# Altium schematic sheet Motor Driver 175C.SchDoc: Motor Driver
size Tabloid; CompanyName: Vertex; Organization: Vertex Downhole Ltd.; Address1: 10911 50th Street SE; Address2: Calgary, AB; Address3: T2C 3E5; Address4: Canada; DocumentNumber: 550014; Revision: 4.1; SheetNumber: 8; SheetTotal: 8
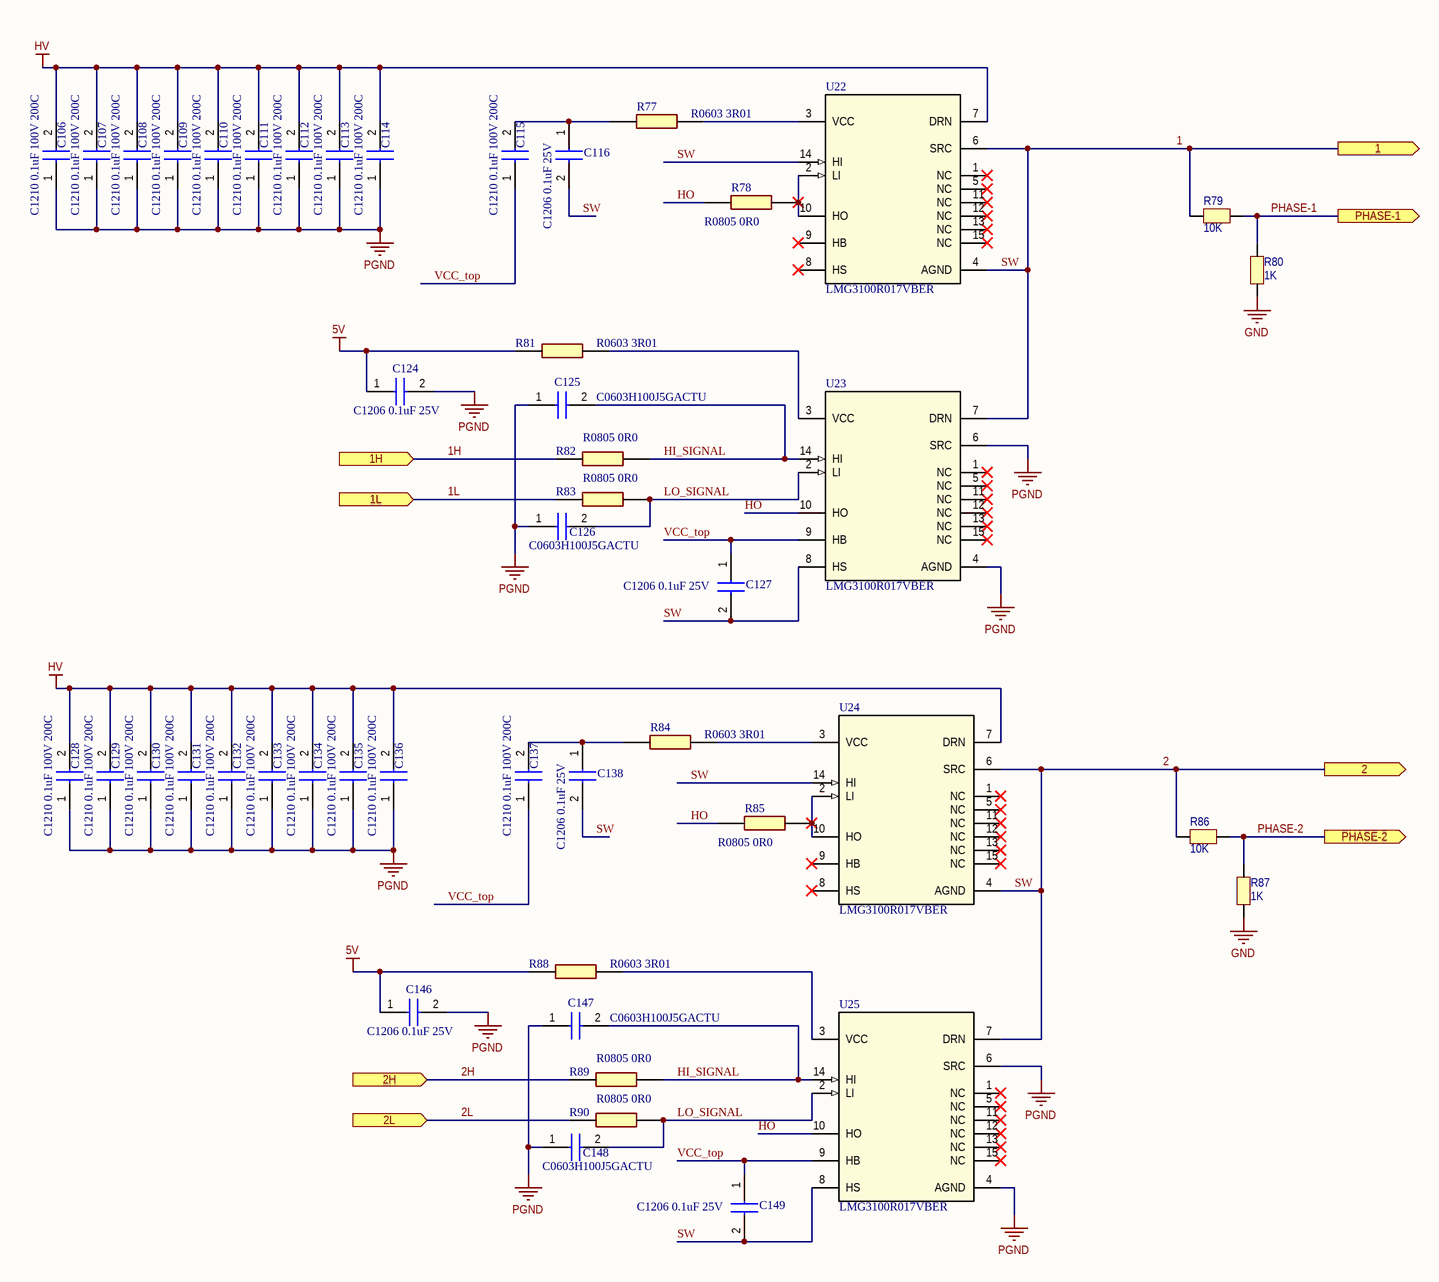
[diagram p0: Motor Driver 175C.SchDoc]

## Parts
C106  C1210 0.1uF 100V 200C  [C1210]
C107  C1210 0.1uF 100V 200C  [C1210]
C108  C1210 0.1uF 100V 200C  [C1210]
C109  C1210 0.1uF 100V 200C  [C1210]
C110  C1210 0.1uF 100V 200C  [C1210]
C111  C1210 0.1uF 100V 200C  [C1210]
C112  C1210 0.1uF 100V 200C  [C1210]
C113  C1210 0.1uF 100V 200C  [C1210]
C114  C1210 0.1uF 100V 200C  [C1210]
C115  C1210 0.1uF 100V 200C  [C1210]
C116  C1206 0.1uF 25V  [C1206]
C124  C1206 0.1uF 25V  [C1206]
C125  C0603H100J5GACTU  [C0603]
C126  C0603H100J5GACTU  [C0603]
C127  C1206 0.1uF 25V  [C1206]
C128  C1210 0.1uF 100V 200C  [C1210]
C129  C1210 0.1uF 100V 200C  [C1210]
C130  C1210 0.1uF 100V 200C  [C1210]
C131  C1210 0.1uF 100V 200C  [C1210]
C132  C1210 0.1uF 100V 200C  [C1210]
C133  C1210 0.1uF 100V 200C  [C1210]
C134  C1210 0.1uF 100V 200C  [C1210]
C135  C1210 0.1uF 100V 200C  [C1210]
C136  C1210 0.1uF 100V 200C  [C1210]
C137  C1210 0.1uF 100V 200C  [C1210]
C138  C1206 0.1uF 25V  [C1206]
C146  C1206 0.1uF 25V  [C1206]
C147  C0603H100J5GACTU  [C0603]
C148  C0603H100J5GACTU  [C0603]
C149  C1206 0.1uF 25V  [C1206]
R77  R0603 3R01  [RESC1608X55N]
R78  R0805 0R0  [RESC2012X60N]
R79  10K  [0805-CR]
R80  1K  [0805-CR]
R81  R0603 3R01  [RESC1608X55N]
R82  R0805 0R0  [RESC2012X60N]
R83  R0805 0R0  [RESC2012X60N]
R84  R0603 3R01  [RESC1608X55N]
R85  R0805 0R0  [RESC2012X60N]
R86  10K  [0805-CR]
R87  1K  [0805-CR]
R88  R0603 3R01  [RESC1608X55N]
R89  R0805 0R0  [RESC2012X60N]
R90  R0805 0R0  [RESC2012X60N]
U22  LMG3100R017VBER  [VBE0015A-MFG]
U23  LMG3100R017VBER  [VBE0015A-MFG]
U24  LMG3100R017VBER  [VBE0015A-MFG]
U25  LMG3100R017VBER  [VBE0015A-MFG]

## Ports
1 (out), 1H (in), 1L (in), 2 (out), 2H (in), 2L (in), PHASE-1 (out), PHASE-2 (out)

## Nets
5V: C124.1 C146.1 R81.1 R88.1
GND: R80.1 R87.1
HV: C106.2 C107.2 C108.2 C109.2 C110.2 C111.2 C112.2 C113.2 C114.2 C128.2 C129.2 C130.2 C131.2 C132.2 C133.2 C134.2 C135.2 C136.2 U22.7(DRN) U24.7(DRN)
PGND: C106.1 C107.1 C108.1 C109.1 C110.1 C111.1 C112.1 C113.1 C114.1 C124.2 C125.1 C126.1 C128.1 C129.1 C130.1 C131.1 C132.1 C133.1 C134.1 C135.1 C136.1 C146.2 C147.1 C148.1 U23.4(AGND) U23.6(SRC) U25.4(AGND) U25.6(SRC)
1: C116.2 C127.2 C138.2 C149.2 R79.1 R86.1 U22.4(AGND) U22.6(SRC) U22.14(HI) U23.7(DRN) U23.8(HS) U24.4(AGND) U24.6(SRC) U24.14(HI) U25.7(DRN) U25.8(HS) ; port 1, port 2  [also labelled 2, SW]
1H: R82.1 ; port 1H
1L: R83.1 ; port 1L
2H: R89.1 ; port 2H
2L: R90.1 ; port 2L
HI_SIGNAL: C125.2 C147.2 R82.2 R89.2 U23.14(HI) U25.14(HI)
HO: R78.1 R85.1 U23.10(HO) U25.10(HO)
LO_SIGNAL: C126.2 C148.2 R83.2 R90.2 U23.2(LI) U25.2(LI)
PHASE-1: R79.2 R80.2 ; port PHASE-1
PHASE-2: R86.2 R87.2 ; port PHASE-2
VCC_top: C115.1 C127.1 C137.1 C149.1 U23.9(HB) U25.9(HB)
NetC115_2: C115.2 C116.1 R77.1
NetC137_2: C137.2 C138.1 R84.1
NetR77_2: R77.2 U22.3(VCC)
NetR78_2: R78.2 U22.2(LI) U22.10(HO)
NetR81_2: R81.2 U23.3(VCC)
NetR84_2: R84.2 U24.3(VCC)
NetR85_2: R85.2 U24.2(LI) U24.10(HO)
NetR88_2: R88.2 U25.3(VCC)

Not connected (* = marked no-connect by the designer): U22 1(NC)* 5(NC)* 8(HS)* 9(HB)* 11(NC)* 12(NC)* 13(NC)* 15(NC)*; U23 1(NC)* 5(NC)* 11(NC)* 12(NC)* 13(NC)* 15(NC)*; U24 1(NC)* 5(NC)* 8(HS)* 9(HB)* 11(NC)* 12(NC)* 13(NC)* 15(NC)*; U25 1(NC)* 5(NC)* 11(NC)* 12(NC)* 13(NC)* 15(NC)*

## Notes on the sheet
- Title
- Size:
- Date:
- Tabloid
- Number:
- Time:
- Revision:
- Sheet
- of
- File:

## Library data of the parts
C106-C115 C128-C137 = C1210H104J1GACTU: Capacitor; Manufacturer_Name: KEMET; Datasheet Link: https://content.kemet.com/datasheets/KEM_C1001_C0G_200C_SMD.pdf; Manufacturer_Part_Number: C1210H104J1GACTU; Mouser Part Number: 80-C1210H104J1GACTU; Mouser Price/Stock: https://www.mouser.co.uk/ProductDetail/KEMET/C1210H104J1GACTU?qs=w3%252Bcv6FlocpP4mccX4tnSA%3D%3D; Operating Temperature Range: -55C to +200C
C116 C124 C127 C138 C146 C149 = C1206H104J3GACTU: Capacitor; Manufacturer_Name: KEMET; Datasheet Link: https://content.kemet.com/datasheets/KEM_C1001_C0G_200C_SMD.pdf; Manufacturer_Part_Number: C1206H104J3GACTU; Mouser Part Number: 80-C1206H104J3GACTU; Mouser Price/Stock: https://www.mouser.co.uk/ProductDetail/KEMET/C1206H104J3GACTU?qs=w3%252Bcv6Flocqnd9vvLtBgyg%3D%3D
C125 C126 C147 C148 = C0603H100J5GACTU: Capacitor; Manufacturer_Name: KEMET; Datasheet Link: https://content.kemet.com/datasheets/KEM_C1001_C0G_200C_SMD.pdf; Height: 0.87mm; Manufacturer_Part_Number: C0603H100J5GACTU
R77 R81 R84 R88 = CPF0603F3R01C1: Configuration Features: Number of Resistors 1; Manufacturer_Name: TE Connectivity; Geometry.Height: 0.55mm; Mouser Part Number: *; Mouser Price/Stock: *; Manufacturer_Part_Number: CPF0603F3R01C1; Datasheet Link: *
R78 R82 R83 R85 R89 R90 = CR0805AJ_-000EAS: Thick Film Resistors - SMD ResA-AS 0805 0R Jumper 125mW; Manufacturer_Name: Bourns; Manufacturer_Part_Number: CR0805AJ/-000EAS; Geometry.Height: 0.6mm; Mouser Part Number: 652-CR0805AJ/-000EAS; Mouser Price/Stock: https://www.mouser.co.uk/ProductDetail/Bourns/CR0805AJ-000EAS?qs=PzGy0jfpSMu9sqFdv6iQ3A%3D%3D; Datasheet Link: https://componentsearchengine.com/Datasheets/1/CR0805AJ_-000EAS.pdf
R79 R86 = RES: Resistor; Manufacturer: Yageo; Vendor PN: 311-10.0KCRCT-ND; Vendor: Digi-Key; Manu PN: RC0805FR-0710KL; Vertex PN: 6181002
R80 R87 = RES: Resistor; Manufacturer: Yageo; Vendor PN: 311-1.00KCRCT-ND; Vendor: Digi-Key; Manu PN: RC0805FR-071KL; Vertex PN: 6180102
U22-U25 = LMG3100R017VBER: 100V 1.7mÎ© GaN FET with integrated driver 15-VQFN-FCRLF -40 to 175; Manufacturer_Name: Texas Instruments; TYPE: TYPE; RefDes: RefDes; Copyright: Copyright (C) 2025 Ultra Librarian. All rights reserved.; Manufacturer_Part_Number: LMG3100R017VBER